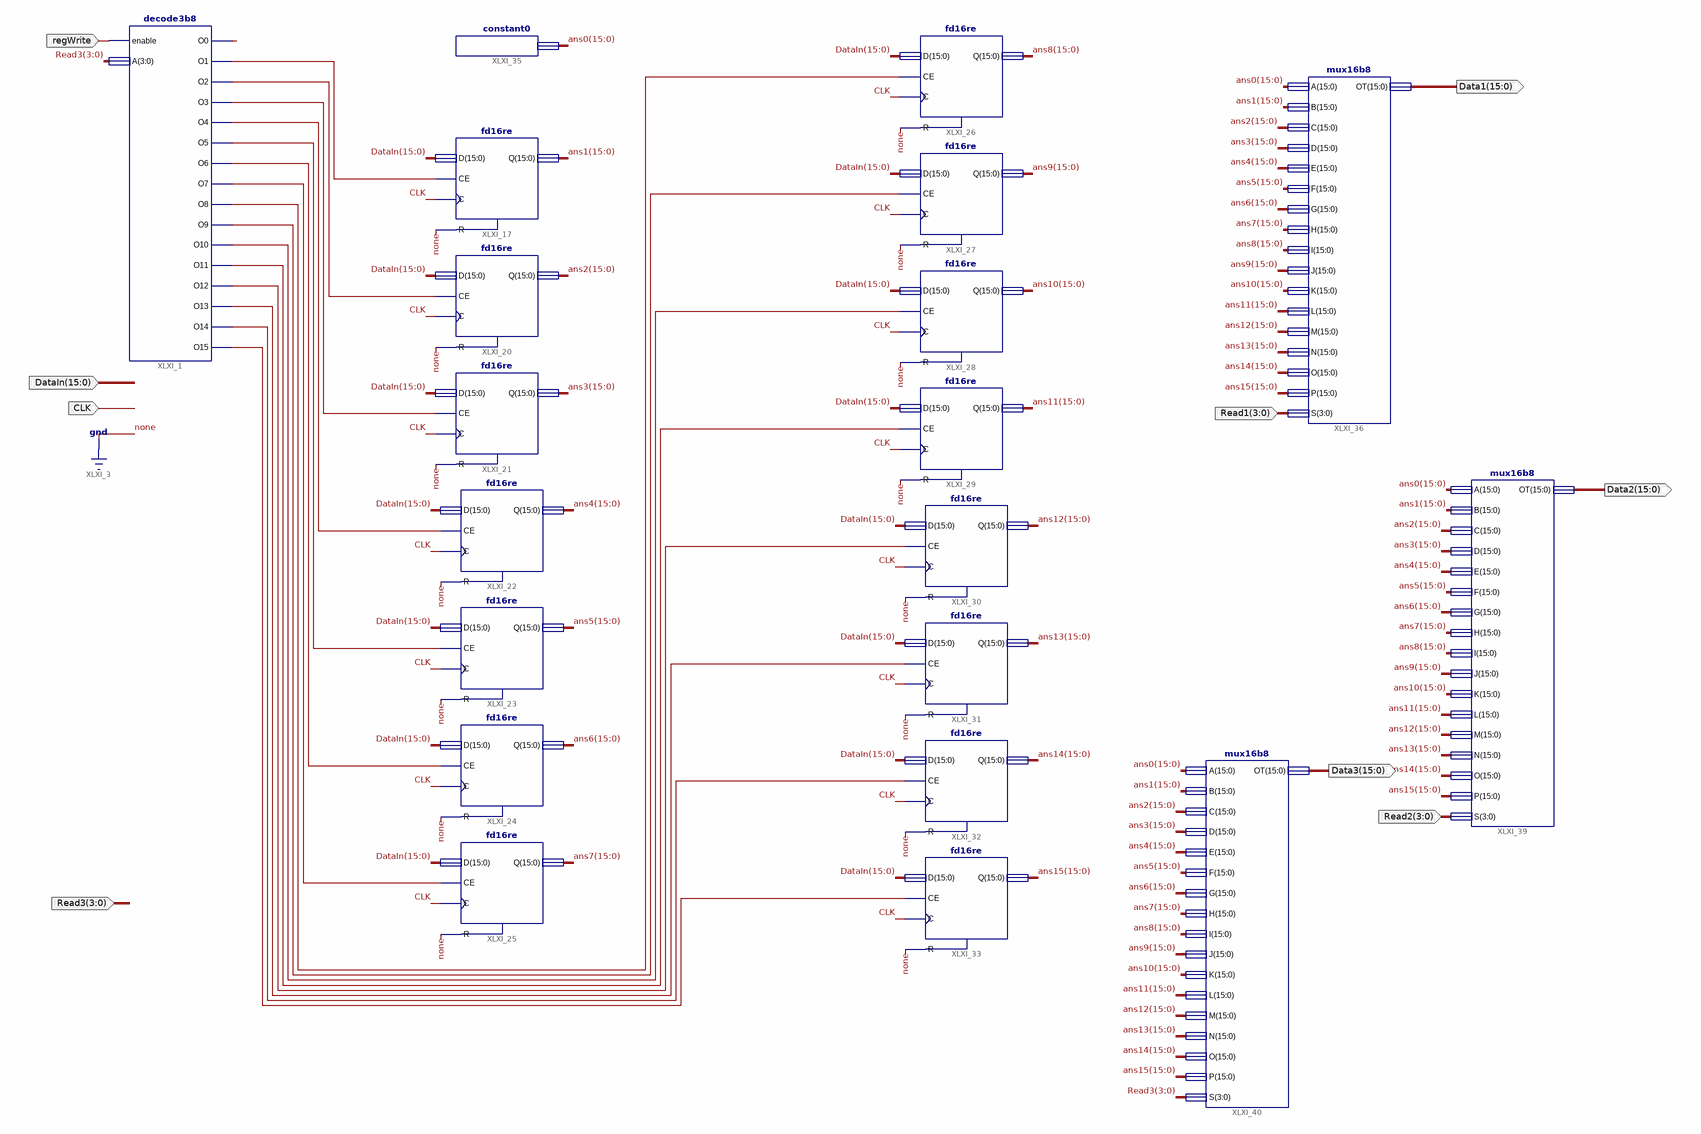
[diagram p0: schematic sheet 1]
// Xilinx ISE schematic RegFile.sch (spartan3e) as structural Verilog: 20 symbols, 9 ports
module RegFile (
  input  regWrite,
  input  [15:0] DataIn,
  input  CLK,
  input  [3:0] Read3,
  input  [3:0] Read1,
  input  [3:0] Read2,
  output [15:0] Data1,
  output [15:0] Data2,
  output [15:0] Data3
);

  wire XLXN_83, XLXN_84, XLXN_85, XLXN_86, XLXN_87, XLXN_88, XLXN_89, XLXN_90, XLXN_125, XLXN_127, XLXN_130,
       XLXN_132, XLXN_134, XLXN_140, XLXN_141, XLXN_143;
  wire [15:0] ans0, ans1, ans2, ans3, ans4, ans5, ans6, ans7, ans8, ans9, ans10, ans11, ans12, ans13, ans14,
       ans15;

  decode3b8 XLXI_1 (
    .A(Read3), .enable(regWrite), .O0(XLXN_83), .O1(XLXN_84), .O2(XLXN_85), .O3(XLXN_86), .O4(XLXN_87),
    .O5(XLXN_88), .O6(XLXN_89), .O7(XLXN_90), .O8(XLXN_125), .O9(XLXN_127), .O10(XLXN_130), .O11(XLXN_132),
    .O12(XLXN_134), .O13(XLXN_141), .O14(XLXN_140), .O15(XLXN_143));
  fd16re XLXI_17 (.C(CLK), .CE(XLXN_84), .D(DataIn), .R(1'b0), .Q(ans1));
  fd16re XLXI_20 (.C(CLK), .CE(XLXN_85), .D(DataIn), .R(1'b0), .Q(ans2));
  fd16re XLXI_21 (.C(CLK), .CE(XLXN_86), .D(DataIn), .R(1'b0), .Q(ans3));
  fd16re XLXI_22 (.C(CLK), .CE(XLXN_87), .D(DataIn), .R(1'b0), .Q(ans4));
  fd16re XLXI_23 (.C(CLK), .CE(XLXN_88), .D(DataIn), .R(1'b0), .Q(ans5));
  fd16re XLXI_24 (.C(CLK), .CE(XLXN_89), .D(DataIn), .R(1'b0), .Q(ans6));
  fd16re XLXI_25 (.C(CLK), .CE(XLXN_90), .D(DataIn), .R(1'b0), .Q(ans7));
  constant0 XLXI_35 (.zero(ans0));
  fd16re XLXI_26 (.C(CLK), .CE(XLXN_125), .D(DataIn), .R(1'b0), .Q(ans8));
  fd16re XLXI_27 (.C(CLK), .CE(XLXN_127), .D(DataIn), .R(1'b0), .Q(ans9));
  fd16re XLXI_28 (.C(CLK), .CE(XLXN_130), .D(DataIn), .R(1'b0), .Q(ans10));
  fd16re XLXI_29 (.C(CLK), .CE(XLXN_132), .D(DataIn), .R(1'b0), .Q(ans11));
  fd16re XLXI_30 (.C(CLK), .CE(XLXN_134), .D(DataIn), .R(1'b0), .Q(ans12));
  fd16re XLXI_31 (.C(CLK), .CE(XLXN_141), .D(DataIn), .R(1'b0), .Q(ans13));
  fd16re XLXI_32 (.C(CLK), .CE(XLXN_140), .D(DataIn), .R(1'b0), .Q(ans14));
  fd16re XLXI_33 (.C(CLK), .CE(XLXN_143), .D(DataIn), .R(1'b0), .Q(ans15));
  mux16b8 XLXI_36 (
    .A(ans0), .B(ans1), .C(ans2), .D(ans3), .E(ans4), .F(ans5), .G(ans6), .H(ans7), .I(ans8), .J(ans9),
    .K(ans10), .L(ans11), .M(ans12), .N(ans13), .O(ans14), .P(ans15), .S(Read1), .OT(Data1));
  mux16b8 XLXI_39 (
    .A(ans0), .B(ans1), .C(ans2), .D(ans3), .E(ans4), .F(ans5), .G(ans6), .H(ans7), .I(ans8), .J(ans9),
    .K(ans10), .L(ans11), .M(ans12), .N(ans13), .O(ans14), .P(ans15), .S(Read2), .OT(Data2));
  mux16b8 XLXI_40 (
    .A(ans0), .B(ans1), .C(ans2), .D(ans3), .E(ans4), .F(ans5), .G(ans6), .H(ans7), .I(ans8), .J(ans9),
    .K(ans10), .L(ans11), .M(ans12), .N(ans13), .O(ans14), .P(ans15), .S(Read3), .OT(Data3));
endmodule
